# Altium project WizBoard.PrjPcb
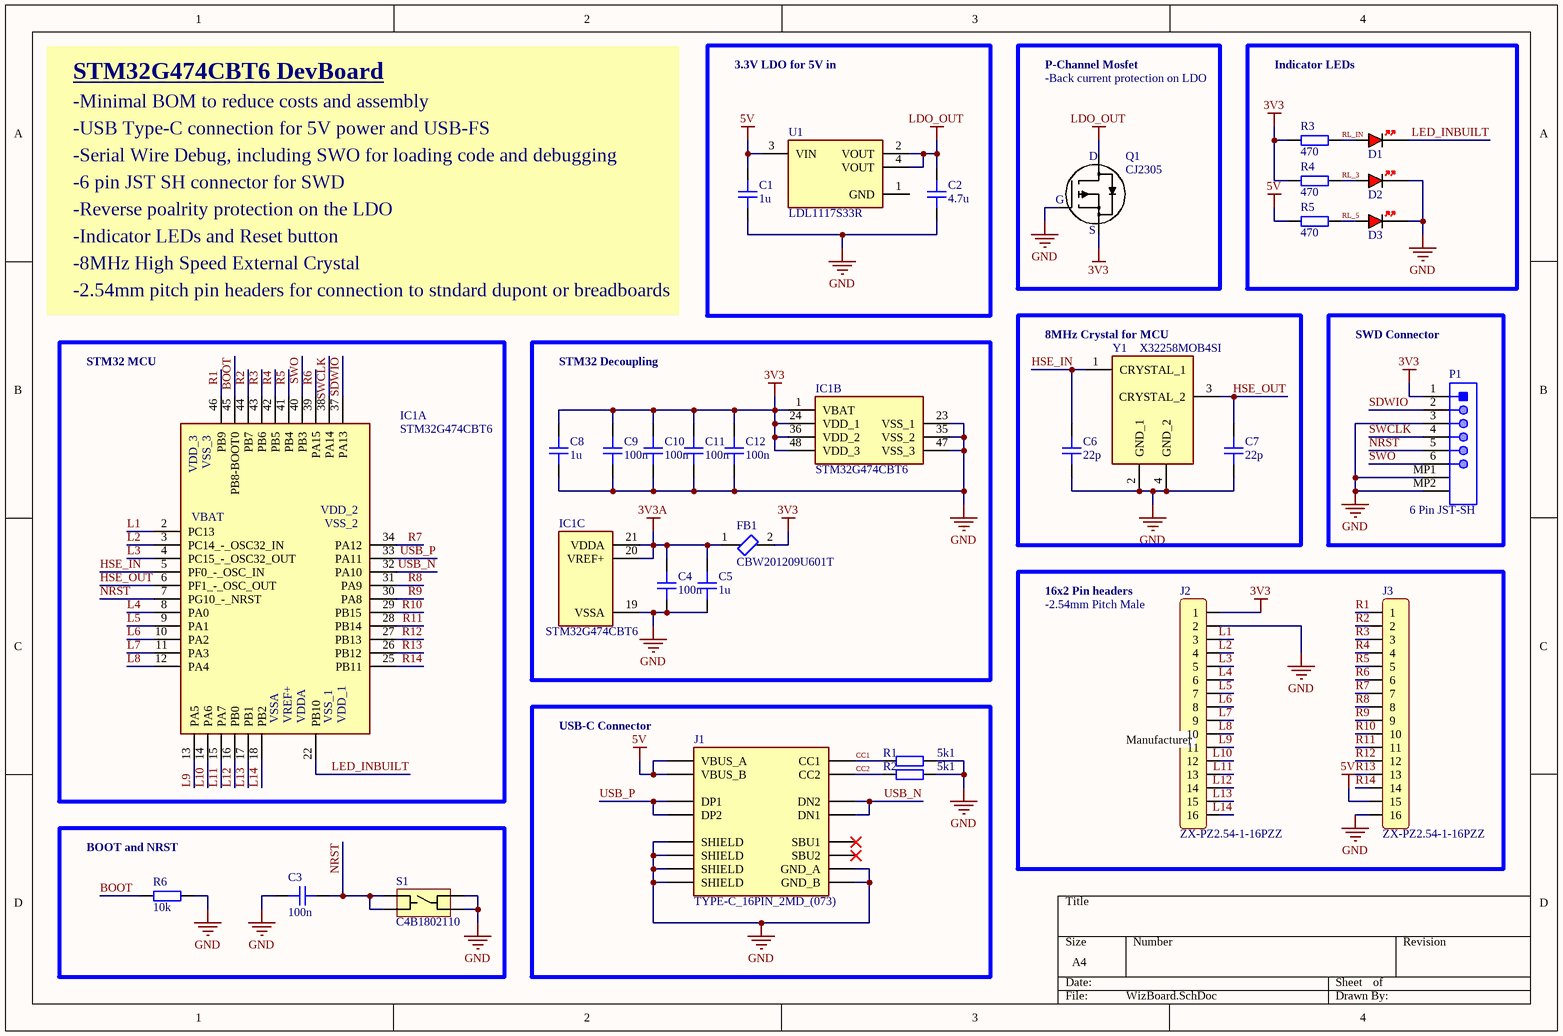
[diagram p0: WizBoard.SchDoc]
1 sheet, 31 parts. Net scope: global (net labels, ports and power ports of the same name join across sheets).
Board file: WizBoard.PcbDoc

## Sheet WizBoard.SchDoc
size A4; SheetNumber: 1; SheetTotal: 1

### Parts
C1  1u  [CAP_0805]
C2  4.7u  [CAP_0805]
C3  100n  [CAP_0805]
C4  100n  [CAP_0805]
C5  1u  [CAP_0805]
C6  22p  [CAP_0805]
C7  22p  [CAP_0805]
C8  1u  [CAP_0805]
C9  100n  [CAP_0805]
C10  100n  [CAP_0805]
C11  100n  [CAP_0805]
C12  100n  [CAP_0805]
D1  RED  [LED_0805_RED]  (value not drawn)
D2  RED  [LED_0805_RED]  (value not drawn)
D3  RED  [LED_0805_RED]  (value not drawn)
FB1  CBW201209U601T  [BEADC2112X105N]
IC1  STM32G474CBT6  [QFP50P900X900X160-48N]  (parts A,B,C of 3)
J1  TYPE-C_16PIN_2MD_(073)  [SHOUHAN_TYPE-C_16PIN_2MD_(073)]
J2  ZX-PZ2.54-1-16PZZ  [16p Pin Header]
J3  ZX-PZ2.54-1-16PZZ  [16p Pin Header]
P1  6 Pin JST-SH  [JST-SM06B-SRSS-TB_V]
Q1  CJ2305  [SOT-23]
R1  5k1  [RES_0805]
R2  5k1  [RES_0805]
R3  470  [RES_0805]
R4  470  [RES_0805]
R5  470  [RES_0805]
R6  10k  [RES_0805]
S1  C4B1802110  [SW-SMD_4P-L3.5-W3.0-P1.50-LS4.7]
U1  LDL1117S33R  [SOT-223]
Y1  X32258MOB4SI  [X32258MOB4SI]

### Blocks framed on the sheet
3.3V LDO for 5V in: C1 C2 U1
Indicator LEDs: D1-D3 R3-R5
STM32 MCU: IC1
STM32 Decoupling: C4 C5 C8-C12 FB1 IC1
8MHz Crystal for MCU: C6 C7 Y1
SWD Connector: P1
USB-C Connector: J1 R1 R2
BOOT and NRST: C3 R6 S1

### Nets
3V3: C8.2 C9.2 C10.2 C11.2 C12.2 FB1.2 IC1.1(VBAT) IC1.24(VDD_1) IC1.36(VDD_2) IC1.48(VDD_3) J2.1 P1.1 Q1.2(Source) R3.1 R4.1
3V3A: C4.2 C5.2 FB1.1 IC1.20(VREF+) IC1.21(VDDA)
5V: C1.2 J1.A4_B9(VBUS_A) J1.B4_A9(VBUS_B) J3.15 R5.1 U1.3(VIN)
GND: C1.1 C2.1 C3.2 C4.1 C5.1 C6.1 C7.1 C8.1 C9.1 C10.1 C11.1 C12.1 D2.K D3.K IC1.19(VSSA) IC1.23(VSS_1) IC1.35(VSS_2) IC1.47(VSS_3) J1.A1_B12(GND_A) J1.B1_A12(GND_B) J1.SH1(SHIELD) J1.SH2(SHIELD) J1.SH3(SHIELD) J1.SH4(SHIELD) J2.2 J3.16 P1.3 P1.MP1 P1.MP2 Q1.1(Gate) R1.2 R2.2 R6.2 S1.3 S1.4 Y1.2(GND_1) Y1.4(GND_2)
LDO_OUT: C2.2 Q1.3(Drain) U1.2(VOUT) U1.4(VOUT)
BOOT: IC1.45(PB8-BOOT0) R6.1
CC1: J1.A5(CC1) R1.1
CC2: J1.B5(CC2) R2.1
HSE_IN: C6.2 IC1.5(PF0_-_OSC_IN) Y1.1(CRYSTAL_1)
HSE_OUT: C7.2 IC1.6(PF1_-_OSC_OUT) Y1.3(CRYSTAL_2)
L1: IC1.2(PC13) J2.3
L2: IC1.3(PC14_-_OSC32_IN) J2.4
L3: IC1.4(PC15_-_OSC32_OUT) J2.5
L4: IC1.8(PA0) J2.6
L5: IC1.9(PA1) J2.7
L6: IC1.10(PA2) J2.8
L7: IC1.11(PA3) J2.9
L8: IC1.12(PA4) J2.10
L9: IC1.13(PA5) J2.11
L10: IC1.14(PA6) J2.12
L11: IC1.15(PA7) J2.13
L12: IC1.16(PB0) J2.14
L13: IC1.17(PB1) J2.15
L14: IC1.18(PB2) J2.16
LED_INBUILT: D1.K IC1.22(PB10)
NRST: C3.1 IC1.7(PG10_-_NRST) P1.5 S1.1 S1.2
R1: IC1.46(PB9) J3.1
R2: IC1.44(PB7) J3.2
R3: IC1.43(PB6) J3.3
R4: IC1.42(PB5) J3.4
R5: IC1.41(PB4) J3.5
R6: IC1.39(PA15) J3.6
R7: IC1.34(PA12) J3.7
R8: IC1.31(PA9) J3.8
R9: IC1.30(PA8) J3.9
R10: IC1.29(PB15) J3.10
R11: IC1.28(PB14) J3.11
R12: IC1.27(PB13) J3.12
R13: IC1.26(PB12) J3.13
R14: IC1.25(PB11) J3.14
RL_3: D2.A R4.2
RL_5: D3.A R5.2
RL_IN: D1.A R3.2
SDWIO: IC1.37(PA13) P1.2
SWCLK: IC1.38(PA14) P1.4
SWO: IC1.40(PB3) P1.6
USB_N: IC1.32(PA10) J1.A7(DN1) J1.B7(DN2)
USB_P: IC1.33(PA11) J1.A6(DP1) J1.B6(DP2)

Not connected (* = marked no-connect by the designer): J1 A8(SBU1)* B8(SBU2)*; U1 1(GND)

### Notes on the sheet
- STM32G474CBT6 DevBoard
- -Minimal BOM to reduce costs and assembly
- P-Channel Mosfet
- -Back current protection on LDO
- -USB Type-C connection for 5V power and USB-FS
- -Serial Wire Debug, including SWO for loading code and debugging
- -6 pin JST SH connector for SWD
- -Reverse poalrity protection on the LDO
- -Indicator LEDs and Reset button
- -8MHz High Speed External Crystal
- -2.54mm pitch pin headers for connection to stndard dupont or breadboards
- 16x2 Pin headers
- (near J2) -2.54mm Pitch Male
- (near J2) Manufacturer
- (in symbol PJM10H01PSA) D; G; S

### Library data of the parts
C1 C5 C8 = CAP_0805: Capacitor SMD 0805; Manufacturer: Samsung Electro-Mechanics; Manufacturer Part Number: CL21B105KAFNNNE; Rating: 25V; Distributor Link: https://www.lcsc.com/product-detail/C116352.html?spm=wm.fly.bg.0.xh___wm.fly.tp.4.ml&lcsc_vid=RgJaBFdeQAVXBFNWRFFdUVZXR1lbUVIAQgJYXwBWRlExVlNRQFhXX1FUQFNYUzsOAxUeFF5JWBYZEEoKFBINSQcJGk4eFQsCAgIaSgADAwAHC0slRVheUFZQTk8GEwkK; LCSC: C116352; Dielectric: *
C2 = CAP_0805: Capacitor SMD 0805; Manufacturer: Samsung Electro-Mechanics; Manufacturer Part Number: CL21A475KBQNNNE; Rating: 50V; Distributor Link: https://www.lcsc.com/product-detail/C98192.html?spm=wm.fly.bg.0.xh___wm.fly.tp.4.ml&lcsc_vid=RgJaBFdeQAVXBFNWRFFdUVZXR1lbUVIAQgJYXwBWRlExVlNRQFhXX1FUQFNYUzsOAxUeFF5JWBYZEEoKFBINSQcJGk4eFQsCAgIaSgADAwAHC0slRVheUFZQTk8GEwkK; LCSC: C98192; Dielectric: *
C3 C4 C9-C12 = CAP_0805: Capacitor SMD 0805; Manufacturer: Samsung Electro-Mechanics; Manufacturer Part Number: CL21B104KBCNNNC; Rating: 50V; Distributor Link: https://www.lcsc.com/product-detail/C1711.html?spm=wm.fly.bg.2.xh___wm.fly.tp.4.ml&lcsc_vid=RgJaBFdeQAVXBFNWRFFdUVZXR1lbUVIAQgJYXwBWRlExVlNRQFhXX1FUQFNYUzsOAxUeFF5JWBYZEEoKFBINSQcJGk4eFQsCAgIaSgADAwAHC0slRVheUFZQTk8GEwkK; LCSC: C1711; Dielectric: *
C6 C7 = CAP_0805: Capacitor SMD 0805; Manufacturer: Samsung Electro-Mechanics; Manufacturer Part Number: CL21C220JBANNNC; Rating: 50V; Distributor Link: https://www.lcsc.com/product-detail/C1804.html?spm=wm.fly.bg.0.xh___wm.fly.tp.4.ml&lcsc_vid=RgJaBFdeQAVXBFNWRFFdUVZXR1lbUVIAQgJYXwBWRlExVlNRQFhXX1FUQFNYUzsOAxUeFF5JWBYZEEoKFBINSQcJGk4eFQsCAgIaSgADAwAHC0slRVheUFZQTk8GEwkK; LCSC: C1804; Dielectric: *
D1-D3 = LED_0805_RED: LED 0805 RED SMD; Manufacturer: XINGLIGHT; Manufacturer Part Number: XL-2012SURC; Distributor Link: https://www.lcsc.com/product-detail/C965812.html?spm=wm.fly.bg.0.xh___wm.mly.mlk.28-19.ml&lcsc_vid=RgJaBFdeQAVXBFNWRFFdUVZXR1lbUVIAQgJYXwBWRlExVlNRT1NbX1BfRVNbUjsOAxUeFF5JWBYZEEoKFBINSQcJGk4dAgUUFAk%3D; LCSC: C965812
FB1 = GZ2012D601TF: Ferrite Beads 600 @ 100MHz 500mA 0805 RoHS; Manufacturer: SUNLORD; Datasheet Link: https://www.lcsc.com/datasheet/C21286.pdf?spm=wm.sxq.inf.ggs___wm.fly.bg.0.xh&lcsc_vid=RgJaBFdeQAVXBFNWRFFdUVZXR1lbUVIAQgJYXwBWRlExVlNRT1NbUFxQRlBdVzsOAxUeFF5JWBYZEEoKFBINSQcJGk4%3D; Height: FH; Manufacturer Part Number: CBW201209U601T; LCSC: C21286
IC1 = STM32G474CBT6: Integrated Circuit; Manufacturer: STMicroelectronics; Manufacturer Part Number: STM32G474CBT6TR; Datasheet Link: https://www.st.com/resource/en/datasheet/stm32g474cb.pdf; Height: 1.6mm; Mouser Part Number: 511-STM32G474CBT6TR; Mouser Price/Stock: https://www.mouser.co.uk/ProductDetail/STMicroelectronics/STM32G474CBT6TR?qs=sPbYRqrBIVmx65Oml6enIQ%3D%3D; Arrow Part Number: STM32G474CBT6TR; Arrow Price/Stock: https://www.arrow.com/en/products/stm32g474cbt6tr/stmicroelectronics.html?utm_currency=USD&region=nac; LCSC: C730123
J1 = TYPE-C_16PIN_2MD_(073): DC-5V 5A Type C USB; Manufacturer: SHOU HAN; Manufacturer Part Number: TYPE-C 16PIN 2MD(073); LCSC: C2765186
J2 J3 = ZX-PZ2.54-1-16PZZ: Pin Header 1 2.5mm 6mm -40℃~+105℃ 3mm 16P 2.54mm 3A 1x16P Through Hole,P=2.54mm Headers, Male Pins RoHS; Manufacturer: Megastar; Manufacturer Part Number: ZX-PZ2.54-1-16PZZ; LCSC: C7501270
P1 = CMP-2000-07080-1: Male Header, Pitch 1 mm, 1 x 6 Position, Height 2.95 mm, -25 to 85 degC, RoHS, Tape and Reel; Manufacturer: JST; Manufacturer Part Number: SM06B-SRSS-TB(LF)(SN); No of Positions: 6; Pitch: 1mm; Style/Orientation: RightAngleHeader/Plug; Datasheet URL: https://datasheet.ciiva.com/26894/getdatasheetpartid-708885-26894671.pdf; Package Description: Male Header, Pitch 1 mm, 1 X 6 Position, Height 2.9 mm; Termination: Solder; Manufacturer URL: http://www.jst.com/home2.html; Type: ShroudedHeader; Package Reference: SM06B-SRSS-TB; Datasheet Version: 11/2010; Mounting Technology: SurfaceMount; LCSC: C160405
Q1 = PJM10H01PSA: P-Channel 12V 4.1A 0.35W Surface Mount SOT-23; Manufacturer: JSCJ; Manufacturer Part Number: CJ2305; LCSC: C8549
R1 R2 = RES_0805: Resistor SMD 0805; Manufacturer: FOJAN; Manufacturer Part Number: FRC0805F5101TS; Distributor Link: https://www.lcsc.com/product-detail/C2907269.html?spm=wm.fly.bg.2.xh___wm.mly.mlk.28-0-0.ml&lcsc_vid=RgJaBFdeQAVXBFNWRFFdUVZXR1lbUVIAQgJYXwBWRlExVlNRQFhXX1ZXT1RaUzsOAxUeFF5JWBYZEEoKFBINSQcJGk4dAgUUFAk%3D; LCSC: C2907269
R3-R5 = RES_0805: Resistor SMD 0805; Manufacturer: FOJAN; Manufacturer Part Number: FRC0805F4700TS; Distributor Link: https://www.lcsc.com/product-detail/C2907267.html?spm=wm.fly.bg.1.stp___wm.mly.mlk.28-0-0.ml&lcsc_vid=RgJaBFdeQAVXBFNWRFFdUVZXR1lbUVIAQgJYXwBWRlExVlNRQFhXX1ZXT1RaUzsOAxUeFF5JWBYZEEoKFBINSQcJGk4dAgUUFAk%3D; LCSC: C2907267
R6 = RES_0805: Resistor SMD 0805; Manufacturer: FOJAN; Manufacturer Part Number: FRC0805F1002TS; Distributor Link: https://www.lcsc.com/product-detail/C2907219.html?spm=wm.fly.bg.1.xh___wm.mly.mlk.28-0-0.ml&lcsc_vid=RgJaBFdeQAVXBFNWRFFdUVZXR1lbUVIAQgJYXwBWRlExVlNRQFhXX1ZXT1RaUzsOAxUeFF5JWBYZEEoKFBINSQcJGk4dAgUUFAk%3D; LCSC: C2907219
S1 = C4B1802110: SMD NO Push Button Switch; Manufacturer: SAMZO; Manufacturer Part Number: C4B1802110; LCSC: C49393608
U1 = LDL1117S33R: IC REG LINEAR 3.3V 1.2A SOT223; Manufacturer: ST; Manufacturer Part Number: LDL1117S33R; LCSC: C435835
Y1 = X32258MOB4SI: Crystal or Oscillator; Manufacturer: YXC; Datasheet Link: https://item.szlcsc.com/datasheet/X32258MOB4SI/2777872.html; Height: 0.8mm; Manufacturer Part Number: X32258MOB4SI; LCSC: C2682775